# Altium project MCU.PrjPcb
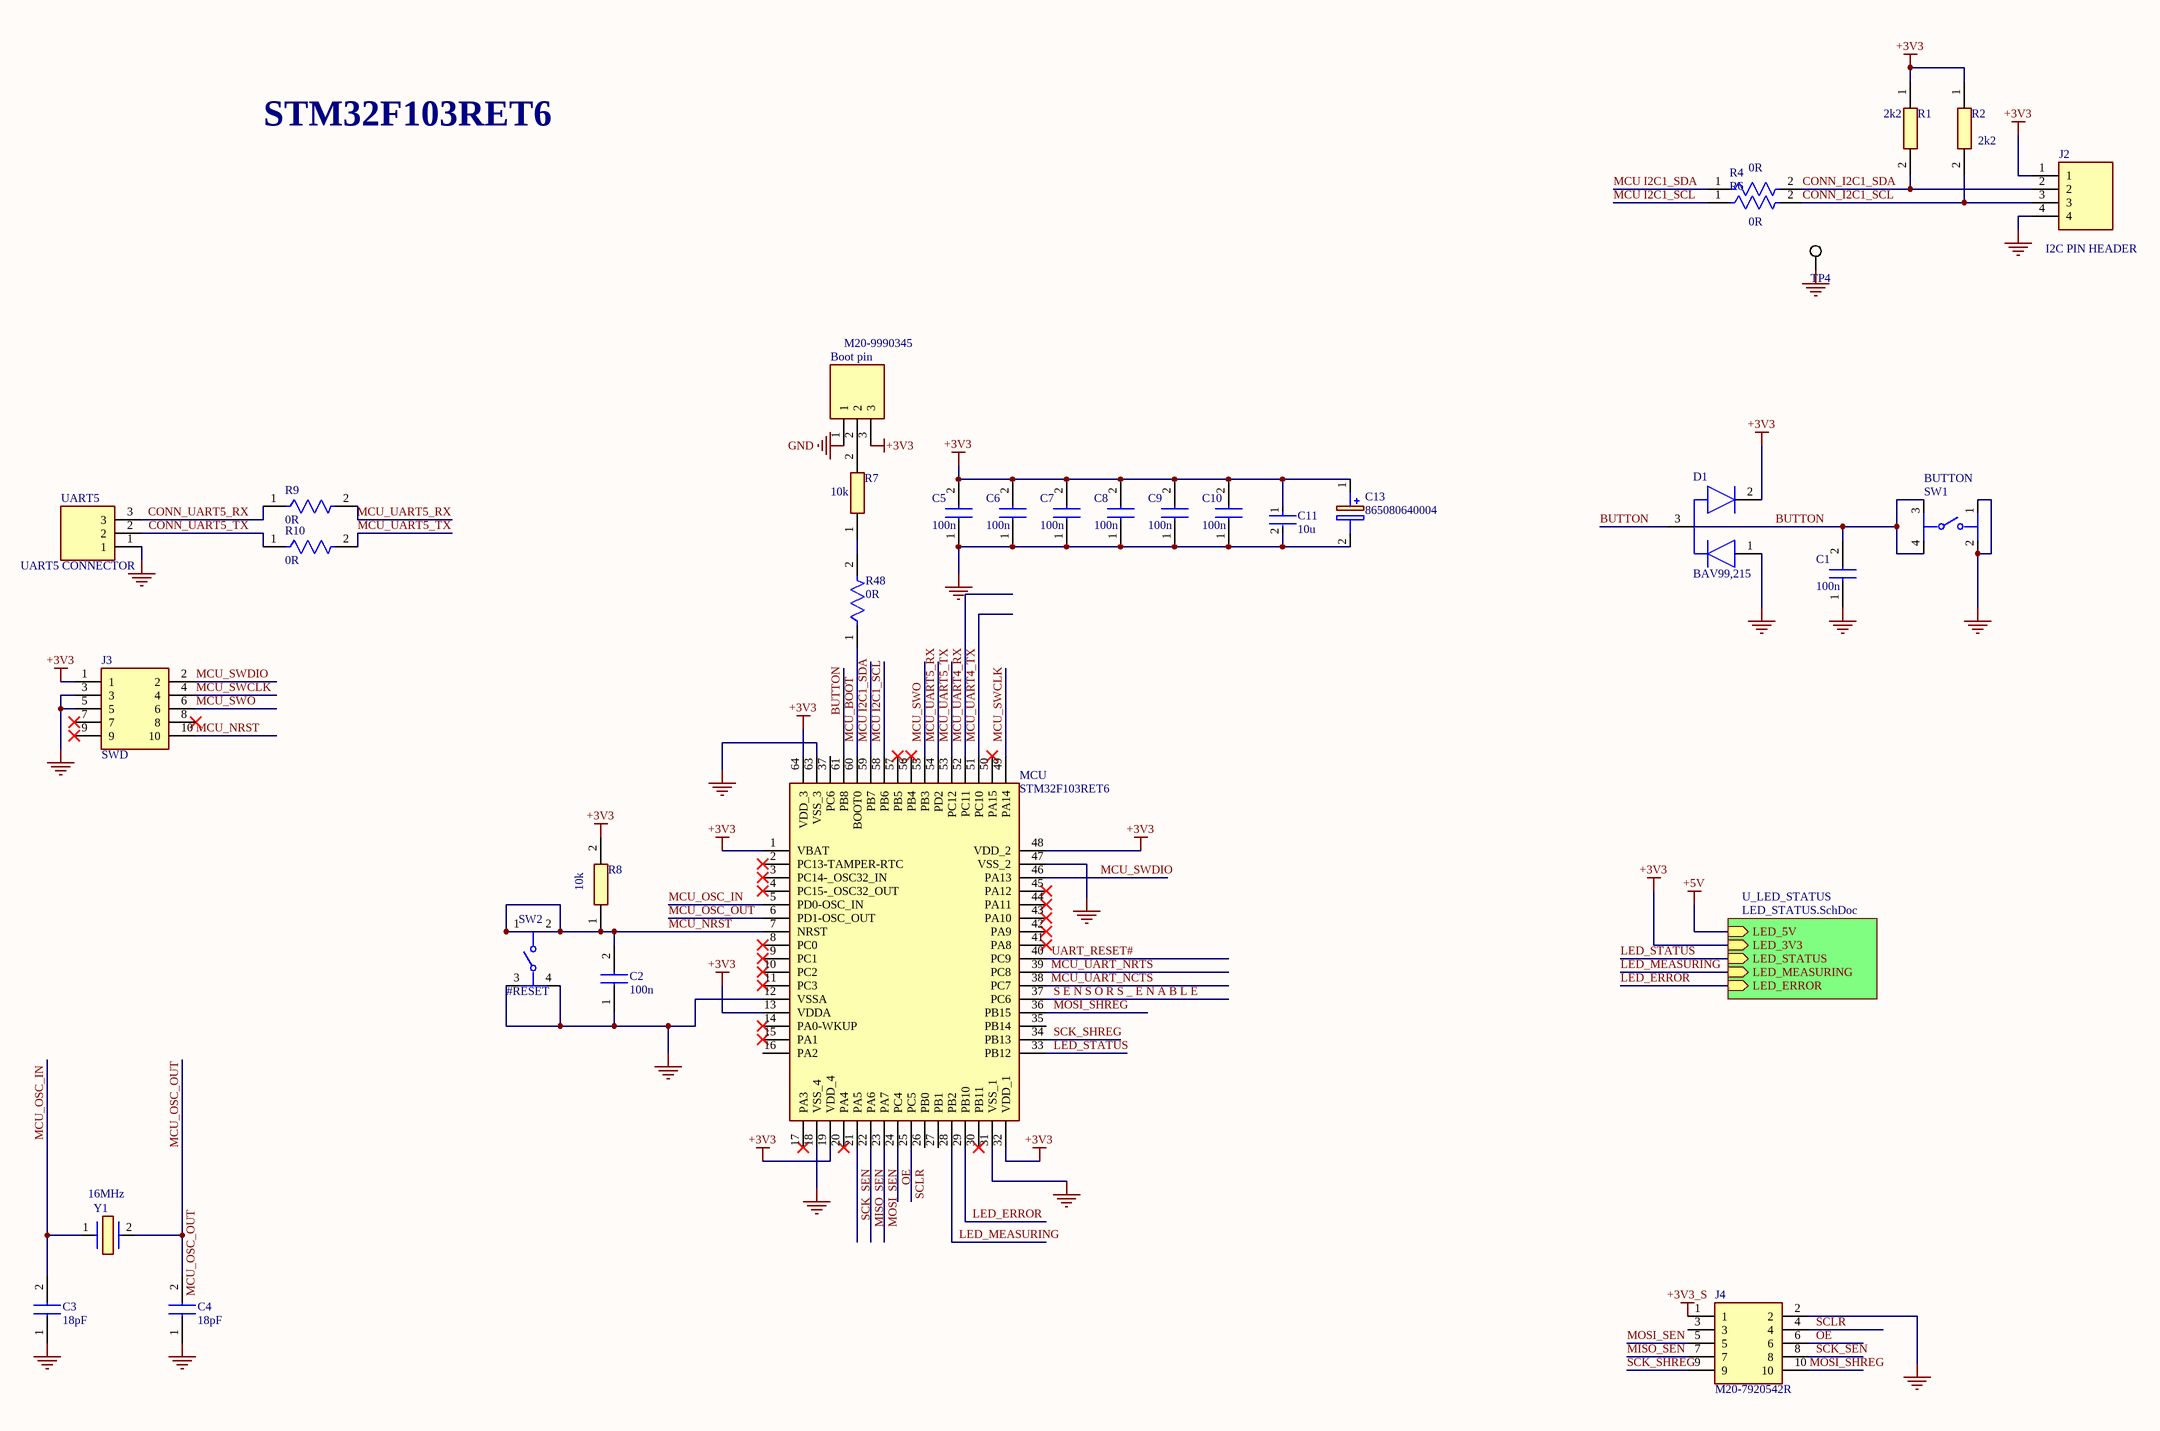
[diagram p0: MCU.SchDoc]
2 sheets, 42 parts. Net scope: hierarchical (ports join the sheet entries above them; power ports are global).
Board file: MCU.PcbDoc
Sheets:
  MCU.SchDoc
    U_LED_STATUS = LED_STATUS.SchDoc

## Sheet MCU.SchDoc
size A2; SheetNumber: 2; SheetTotal: 5

### Parts
Boot_pin  M20-9990345  [HDRV3W64P0X254_1X3_762X254X864P]
C1  100n  [CAPC1608X95N]
C2  100n  [CAPC1608X90N]
C3  18pF  [C0603]
C4  18pF  [C0603]
C5  100n  [CAPC1608X95N]
C6  100n  [CAPC1608X95N]
C7  100n  [CAPC1608X95N]
C8  100n  [CAPC1608X95N]
C9  100n  [CAPC1608X95N]
C10  100n  [CAPC1608X95N]
C11  10u  [FP-GRM188-0_2-IPC_A]
C13  865080640004  [865080640004]
D1  BAV99,215  [BAV99215]
J2  I2C PIN HEADER  [HDRV4W90P0X254_1X4_994X249X560P]
J3  SWD  [HDRV10W64P254_2X5_1270X508X834P]
J4  M20-7920542R  [M207920542R]
MCU  STM32F103RET6  [QFP50P1200X1200X160-64N]
R1  2k2  [RESC1608X55N]
R2  2k2  [RESC1608X55N]
R4  0R  [FP-ERJ-3GEY0R00V-MFG]
R6  0R  [FP-ERJ-3GEY0R00V-MFG]
R7  10k  [RESC1608X55N]
R8  10k  [RESC1608X55N]
R9  0R  [FP-ERJ-3GEY0R00V-MFG]
R10  0R  [FP-ERJ-3GEY0R00V-MFG]
R48  0R  [FP-ERJ-3GEY0R00V-MFG]
SW1  BUTTON  [FP-PTS645SM43SMTR92LFS-MFG]
SW2  #RESET  [FP-PTS645SM43SMTR92LFS-MFG]
TP4  5019  [KSTN-5019_V]  (value not drawn)
UART5  UART5 CONNECTOR  [HDRV3W64P0X254_1X3_762X254X864P]
Y1  16MHz  [ABLS]

### Sub-sheets
U_LED_STATUS = LED_STATUS.SchDoc: LED_MEASURING (in), LED_ERROR (in), LED_STATUS (in), LED_5V (in), LED_3V3 (in)

### Nets
+3V3: Boot_pin.3 C5.2 C6.2 C7.2 C8.2 C9.2 C10.2 C11.1 C13.1(+) D1.2(E) J2.1 J3.1 MCU.1(VBAT) MCU.13(VDDA) MCU.19(VDD_4) MCU.32(VDD_1) MCU.48(VDD_2) MCU.64(VDD_3) R1.1 R2.1 R8.2 ; sheet U_LED_STATUS/LED_3V3
+3V3_S: J4.1
GND: Boot_pin.1 C1.1 C2.1 C3.1 C4.1 C5.1 C6.1 C7.1 C8.1 C9.1 C10.1 C11.2 C13.2(-) D1.1(B) J2.4 J3.3 J3.5 J4.2 MCU.12(VSSA) MCU.18(VSS_4) MCU.31(VSS_1) MCU.47(VSS_2) MCU.63(VSS_3) SW1.1 SW1.2 SW2.3 SW2.4 TP4.1 UART5.1
BUTTON: C1.2 D1.3(C) MCU.61(PB8) SW1.3 SW1.4
CONN_I2C1_SCL: J2.3 R2.2 R6.2
CONN_I2C1_SDA: J2.2 R1.2 R4.2
CONN_UART5_RX: R9.1 UART5.3
CONN_UART5_TX: R10.1 UART5.2
LED_ERROR: MCU.29(PB10) ; sheet U_LED_STATUS/LED_ERROR
LED_MEASURING: MCU.28(PB2) ; sheet U_LED_STATUS/LED_MEASURING
LED_STATUS: MCU.33(PB12) ; sheet U_LED_STATUS/LED_STATUS
MCU I2C1_SCL: MCU.58(PB6) R6.1
MCU I2C1_SDA: MCU.59(PB7) R4.1
MCU_BOOT: MCU.60(BOOT0) R48.1
MCU_NRST: C2.2 J3.10 MCU.7(NRST) R8.1 SW2.1 SW2.2
MCU_OSC_IN: C3.2 MCU.5(PD0-OSC_IN) Y1.1
MCU_OSC_OUT: C4.2 MCU.6(PD1-OSC_OUT) Y1.2
MCU_SWCLK: J3.4 MCU.49(PA14)
MCU_SWDIO: J3.2 MCU.46(PA13)
MCU_SWO: J3.6 MCU.55(PB3)
MCU_UART4_RX: MCU.52(PC11)
MCU_UART4_TX: MCU.51(PC10)
MCU_UART5_RX: MCU.54(PD2) R9.2
MCU_UART5_TX: MCU.53(PC12) R10.2
MCU_UART_NCTS: MCU.38(PC7)
MCU_UART_NRTS: MCU.39(PC8)
MISO_SEN: J4.7 MCU.22(PA6)
MOSI_SEN: J4.5 MCU.23(PA7)
MOSI_SHREG: J4.10 MCU.36(PB15)
OE: J4.6 MCU.24(PC4)
~{S} ~{E} ~{N} ~{S} ~{O} ~{R} ~{S} ~{_} ~{E} ~{N} ~{A} ~{B} ~{L} ~{E}: MCU.37(PC6)
SCK_SEN: J4.8 MCU.21(PA5)
SCK_SHREG: J4.9 MCU.34(PB13)
SCLR: J4.4 MCU.25(PC5)
UART_RESET#: MCU.40(PC9)
NetBoot_pin_2: Boot_pin.2 R7.2
NetR7_1: R7.1 R48.2

Not connected (* = marked no-connect by the designer): J3 7* 8* 9*; J4 3; MCU 2(PC13-TAMPER-RTC)* 3(PC14-_OSC32_IN)* 4(PC15-_OSC32_OUT)* 8(PC0)* 9(PC1)* 10(PC2)* 11(PC3)* 14(PA0-WKUP)* 15(PA1)* 16(PA2) 17(PA3)* 20(PA4)* 26(PB0) 27(PB1) 30(PB11)* 35(PB14) 41(PA8)* 42(PA9)* 43(PA10)* 44(PA11)* 45(PA12)* 50(PA15)* 56(PB4)* 57(PB5)*

### Notes on the sheet
- STM32F103RET6

### Library data of the parts
Boot_pin UART5 = M20-9990345: Connector; Manufacturer_Name: Harwin; Datasheet Link: https://cdn.harwin.com/pdfs/M20-999.pdf; Height: 8.64mm; Manufacturer_Part_Number: M20-9990345; Mouser Part Number: 855-M20-9990345; Mouser Price/Stock: https://www.mouser.co.uk/ProductDetail/Harwin/M20-9990345?qs=ulE8k0yEMYbl6ZPCtNdmpA%3D%3D
C1 C5-C10 = C0603C104J4RAC: Capacitor; Manufacturer_Name: KEMET; Datasheet Link: https://datasheet.datasheetarchive.com/originals/distributors/SFDatasheet-4/sf-00083930.pdf; Height: 0.95mm; Manufacturer_Part_Number: C0603C104J4RAC; Mouser Part Number: 80-C0603C104J4RAC; Mouser Price/Stock: https://www.mouser.co.uk/ProductDetail/KEMET/C0603C104J4RAC?qs=sykUljcfnH31MXmq5HGjkg%3D%3D; Arrow Part Number: C0603C104J4RAC; Arrow Price/Stock: https://www.arrow.com/en/products/c0603c104j4rac/kemet-corporation?region=nac
C2 = CL10A105KA8NFNC: Capacitor; Manufacturer_Name: SAMSUNG; Datasheet Link: https://www.mouser.co.za/datasheet/2/585/MLCC-1837944.pdf; Height: 0.9mm; Manufacturer_Part_Number: CL10A105KA8NFNC; Mouser Part Number: 187-CL10A105KA8NFNC; Mouser Price/Stock: https://www.mouser.co.uk/ProductDetail/Samsung-Electro-Mechanics/CL10A105KA8NFNC?qs=%252B6g0mu59x7ItvV%2F7DV9Lig%3D%3D; Arrow Part Number: CL10A105KA8NFNC; Arrow Price/Stock: https://www.arrow.com/en/products/cl10a105ka8nfnc/samsung-electro-mechanics?region=nac
C3 C4 = C0603C180K4HACTU: Capacitor; Manufacturer_Name: KEMET; Datasheet Link: https://content.kemet.com/datasheets/KEM_C1007_X8R_ULTRA_150C_SMD.pdf; Height: 0.87mm; Manufacturer_Part_Number: C0603C180K4HACTU; Mouser Part Number: 80-C0603C180K4HACTU; Mouser Price/Stock: https://www.mouser.com/Search/Refine.aspx?Keyword=80-C0603C180K4HACTU
C11 = CMP-2006-02814-2: Chip Multilayer Ceramic Capacitors for General Purpose, 0603, 10uF, X5R, 15%, 20%, 16V; Width: 0.031inch; Case/Package: 0603; Mount: Surface Mount; Capacitance: 10uF; Depth: 0.8mm; REACH SVHC: No SVHC; Lead Free: Lead Free; Tolerance: 20%; Case Code (Imperial): 0603; Voltage Rating: 16V; Height: 0.8mm; Case Code (Metric): 1608; Thickness: 0.031inch; Voltage: 16V; Voltage Rating (DC): 16V; Length: 1.6mm; Max Operating Temperature: 85°C; Dielectric: X5R; Min Operating Temperature: -55°C; Packaging: Tape and Reel; Package Quantity: 4000
C13 = 865080640004: Capacitor Polarised; Manufacturer_Name: Wurth Elektronik; Datasheet Link: https://www.we-online.de/katalog/datasheet/865080640004.pdf; Height: 5.5mm; Manufacturer_Part_Number: 865080640004; Mouser Part Number: 710-865080640004; Mouser Price/Stock: https://www.mouser.co.uk/ProductDetail/Wurth-Elektronik/865080640004?qs=0KOYDY2FL2%2FjY4kqBxIvAg%3D%3D
D1 = BAV99,215: Diode; Manufacturer_Name: Nexperia; Datasheet Link: https://assets.nexperia.com/documents/data-sheet/BAV99_SER.pdf; Height: 1.1mm; Manufacturer_Part_Number: BAV99,215; Mouser Part Number: 771-BAV99-T/R; Mouser Price/Stock: https://www.mouser.co.uk/ProductDetail/Nexperia/BAV99215?qs=me8TqzrmIYWbN0bCKV3n5w%3D%3D; Arrow Part Number: BAV99,215; Arrow Price/Stock: https://www.arrow.com/en/products/bav99215/nexperia?region=nac
J2 = 90120-0764: Connector; Manufacturer_Name: Molex; Datasheet Link: https://www.molex.com/webdocs/datasheets/pdf/en-us/0901200764_PCB_HEADERS.pdf; Height: 5.6mm; Manufacturer_Part_Number: 90120-0764; Mouser Part Number: 538-90120-0764; Mouser Price/Stock: https://www.mouser.co.uk/ProductDetail/Molex/90120-0764?qs=QSnLD11VNirsMTdnHEPG3Q%3D%3D
J3 = M20-9760542: Connector; Manufacturer_Name: Harwin; Datasheet Link: https://cdn.harwin.com/pdfs/M20-976.pdf; Height: 8.34mm; Manufacturer_Part_Number: M20-9760542; Mouser Part Number: 855-M20-9760542; Mouser Price/Stock: https://www.mouser.co.uk/ProductDetail/Harwin/M20-9760542?qs=WS5Jv%252B%252Bx1qWXnFWOyfr5DQ%3D%3D
J4 = M20-7920542R: Connector; Manufacturer_Name: Harwin; Datasheet Link: https://cdn.harwin.com/pdfs/M20-792R.pdf; Height: 5mm; Manufacturer_Part_Number: M20-7920542R; Mouser Part Number: 855-M20-7920542R; Mouser Price/Stock: https://www.mouser.co.uk/ProductDetail/Harwin/M20-7920542R?qs=k41KVqW3ymqj80AqJ%2FxUlA%3D%3D
MCU = STM32F103RET6: Integrated Circuit; Manufacturer_Name: STMicroelectronics; Datasheet Link: http://www.st.com/st-web-ui/static/active/en/resource/technical/document/datasheet/CD00191185.pdf; Height: 1.6mm; Manufacturer_Part_Number: STM32F103RET6; Mouser Part Number: 511-STM32F103RET6; Mouser Price/Stock: https://www.mouser.co.uk/ProductDetail/STMicroelectronics/STM32F103RET6?qs=tZXS5FmuAdnGL83bu1Xcew%3D%3D; Arrow Part Number: STM32F103RET6; Arrow Price/Stock: https://www.arrow.com/en/products/stm32f103ret6/stmicroelectronics?region=nac
R1 R2 R7 R8 = RK73B1JTTD103J: Resistor; Manufacturer_Name: KOA Speer; Datasheet Link: http://www.koaspeer.com/catimages/Products/RK73-RT/RK73-RT.pdf; Height: 0.55mm; Manufacturer_Part_Number: RK73B1JTTD103J; Mouser Part Number: 660-RK73B1JTTD103J; Mouser Price/Stock: https://www.mouser.co.uk/ProductDetail/KOA-Speer/RK73B1JTTD103J?qs=hmtrJ2UjXcBKRTcwO9LloQ%3D%3D; Arrow Part Number: RK73B1JTTD103J; Arrow Price/Stock: https://www.arrow.com/en/products/rk73b1jttd103j/koa-speer-electronics?region=asia
R4 R6 R9 R10 R48 = CMP-2000-00700-2: RES SMD 0 OHM JUMPER 1/10W 0603; Manufacturer Part Number: ERJ-3GEY0R00V; Manufacturer: Panasonic; Tolerance: 5%; Automotive Grade: Grade 0; Voltage Rating: 75V; Value: 0Ω; Temperature Coefficient: -100/+600ppm/°C; Power Rating: 0.1W; Mouser Description: Resistor, Chip Thick Film, 0 Ohm, 0.1w, Resistor, Chip Thick Film, 0 Ohm, 0.1w, 5%; Ipc Land Pattern Name: RESC16080X45; Category: Res; Package: 0603; Temperature: -55°C to +155°C; Temperature Range Low: -55°C; Series: ERJ; Resistance: 0Ω; RoHS: TRUE; Composition: Thick Film; Octopart: https://octopart.com/erj-3gey0r00v-panasonic-55389238; Device Class L1: Passive Components; Footprint Url: https://industrial.panasonic.com/cdbs/www-data/pdf/RDA0000/DMA0000COL17.pdf; ComponentLink2Description: Datasheet; Device Class L2: Resistors; Temperature Range High: +155°C; Digikey Description: RES SMD 0 OHM JUMPER 1/10W 0603; Lead Free: Yes; Device Class L3: Chip SMD Resistors; Height: 0.55mm; ComponentLink2URL: https://industrial.panasonic.com/cdbs/www-data/pdf/RDA0000/AOA0000C301.pdf; Automotive: Yes
SW1 SW2 = CMP-2000-05160-2: SWITCH TACTILE SPST-NO 0.05A 12V; Contact Resistance: 100mR; Throw Configuration: SPST; Illumination Type: Non-Illuminated; Mechanical Life: 100000Cycles; Current Rating: 50mA; Switch Function: Off-Mom; Actuator Length: 0.85mm; Actuator Material: Nylon; Actuator Type: Standard; Operating Force: 160gf; Min Operating Temperature: -20°C; REACH SVHC: No SVHC; Termination: Gull Wing; Case/Package: SMD/SMT; Packaging: Tape and Reel; Mount: Surface Mount; Voltage Rating (DC): 12V; Orientation: Straight; Lead Free: Lead Free; Contact Material: Silver; Color: Black; Max Current Rating: 50mA; Contact Plating: Silver; Depth: 9mm; Package Quantity: 1; Max Voltage Rating (DC): 12V; Length: 6mm; Max Operating Temperature: 60°C
TP4 = CMP-1672-00008-1: Test Point, 1 Position SMD, RoHS, Tape and Reel; ComponentLink1Description: Manufacturer URL; Package Quantity: 1000; DatasheetVersion: 03/2014; Packaging: Tape and Reel; ComponentLink2URL: http://www.keyelco.com/product-pdf.cfm?p=1357; ComponentLink1URL: http://www.keyelco.com/; Mount: Surface Mount; Contact Plating: Silver; PackageDescription: 1-Pin Surface Mount Device, Body 3.81 x 2.03 mm; Pins: 1; RoHSCompliant: True; Mounting Technology: Surface Mount; ComponentLink2Description: Datasheet; PackageReference: 5019
Y1 = ABLS-16.000MHZ-B2-T: Crystal or Oscillator; Manufacturer_Name: ABRACON; Datasheet Link: https://abracon.com/Resonators/ABLS.pdf; Manufacturer_Part_Number: ABLS-16.000MHZ-B2-T; Mouser Part Number: 815-ABLS-16-B2; Mouser Price/Stock: https://www.mouser.co.uk/ProductDetail/ABRACON/ABLS-16000MHZ-B2-T?qs=m%252BUhWDcpCfbvl4COQ0ty%2FA%3D%3D; Arrow Part Number: ABLS-16.000MHZ-B2-T; Arrow Price/Stock: https://www.arrow.com/en/products/abls-16.000mhz-b2-t/abracon?region=nac

## Sheet LED_STATUS.SchDoc
size A4; SheetNumber: 2; SheetTotal: 2
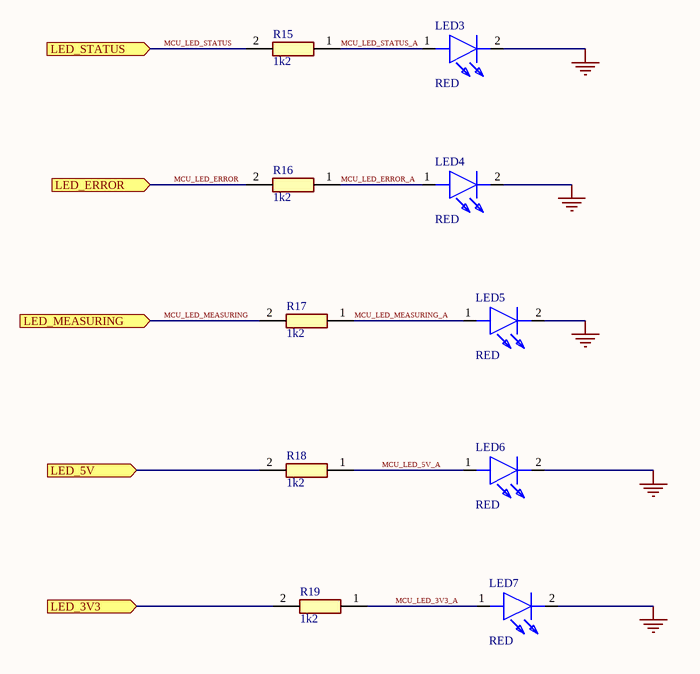
[diagram p1: LED_STATUS.SchDoc]

### Parts
LED3  RED  [APT2012SECKJ3PRV]
LED4  RED  [APT2012SECKJ3PRV]
LED5  RED  [APT2012SECKJ3PRV]
LED6  RED  [APT2012SECKJ3PRV]
LED7  RED  [APT2012SECKJ3PRV]
R15  1k2  [RESC1608X55N]
R16  1k2  [RESC1608X55N]
R17  1k2  [RESC1608X55N]
R18  1k2  [RESC1608X55N]
R19  1k2  [RESC1608X55N]

### Ports
LED_3V3 (in), LED_5V (in), LED_ERROR (in), LED_MEASURING (in), LED_STATUS (in)

### Nets
+3V3: R19.2 ; port LED_3V3
+5V: R18.2 ; port LED_5V
GND: LED3.2(K) LED4.2(K) LED5.2(K) LED6.2(K) LED7.2(K)
MCU_LED_3V3_A: LED7.1(A) R19.1
MCU_LED_5V_A: LED6.1(A) R18.1
MCU_LED_ERROR: R16.2 ; port LED_ERROR  [project net LED_ERROR]
MCU_LED_ERROR_A: LED4.1(A) R16.1
MCU_LED_MEASURING: R17.2 ; port LED_MEASURING  [project net LED_MEASURING]
MCU_LED_MEASURING_A: LED5.1(A) R17.1
MCU_LED_STATUS: R15.2 ; port LED_STATUS  [project net LED_STATUS]
MCU_LED_STATUS_A: LED3.1(A) R15.1

### Library data of the parts
LED3-LED7 = APT2012SECK_J3-PRV: LED; Manufacturer_Name: Kingbright; Manufacturer_Part_Number: APT2012SECK/J3-PRV; Datasheet Link: https://www.mouser.de/datasheet/2/216/APT2012SECK-J3-PRV-1173389.pdf; Height: 0.85mm; Mouser Part Number: 604-APT2012SECKJ3PRV; Mouser Price/Stock: https://www.mouser.co.uk/ProductDetail/Kingbright/APT2012SECK-J3-PRV?qs=D2TOvUWgdJ6T9J6WfI%252BQOg%3D%3D; Arrow Part Number: APT2012SECK/J3-PRV; Arrow Price/Stock: https://www.arrow.com/en/products/apt2012seckj3-prv/kingbright?region=nac
R15-R19 = RK73B1JTTD103J: Resistor; Manufacturer_Name: KOA Speer; Datasheet Link: http://www.koaspeer.com/catimages/Products/RK73-RT/RK73-RT.pdf; Height: 0.55mm; Manufacturer_Part_Number: RK73B1JTTD103J; Mouser Part Number: 660-RK73B1JTTD103J; Mouser Price/Stock: https://www.mouser.co.uk/ProductDetail/KOA-Speer/RK73B1JTTD103J?qs=hmtrJ2UjXcBKRTcwO9LloQ%3D%3D; Arrow Part Number: RK73B1JTTD103J; Arrow Price/Stock: https://www.arrow.com/en/products/rk73b1jttd103j/koa-speer-electronics?region=asia

## Nets that join several sheets
+3V3: MCU (21 pins), LED_STATUS (R19.2)
GND: MCU (29 pins), LED_STATUS (5 pins)
LED_ERROR: MCU (MCU.29), LED_STATUS (R16.2)
LED_MEASURING: MCU (MCU.28), LED_STATUS (R17.2)
LED_STATUS: MCU (MCU.33), LED_STATUS (R15.2)